# Altium schematic sheet Bank_A-B-C-D.SchDoc
size 431 x 279 mm; DrawnBy: Santiago Rodriguez; DocumentNumber: 9; Revision: V1; SheetNumber: 10; SheetTotal: 10
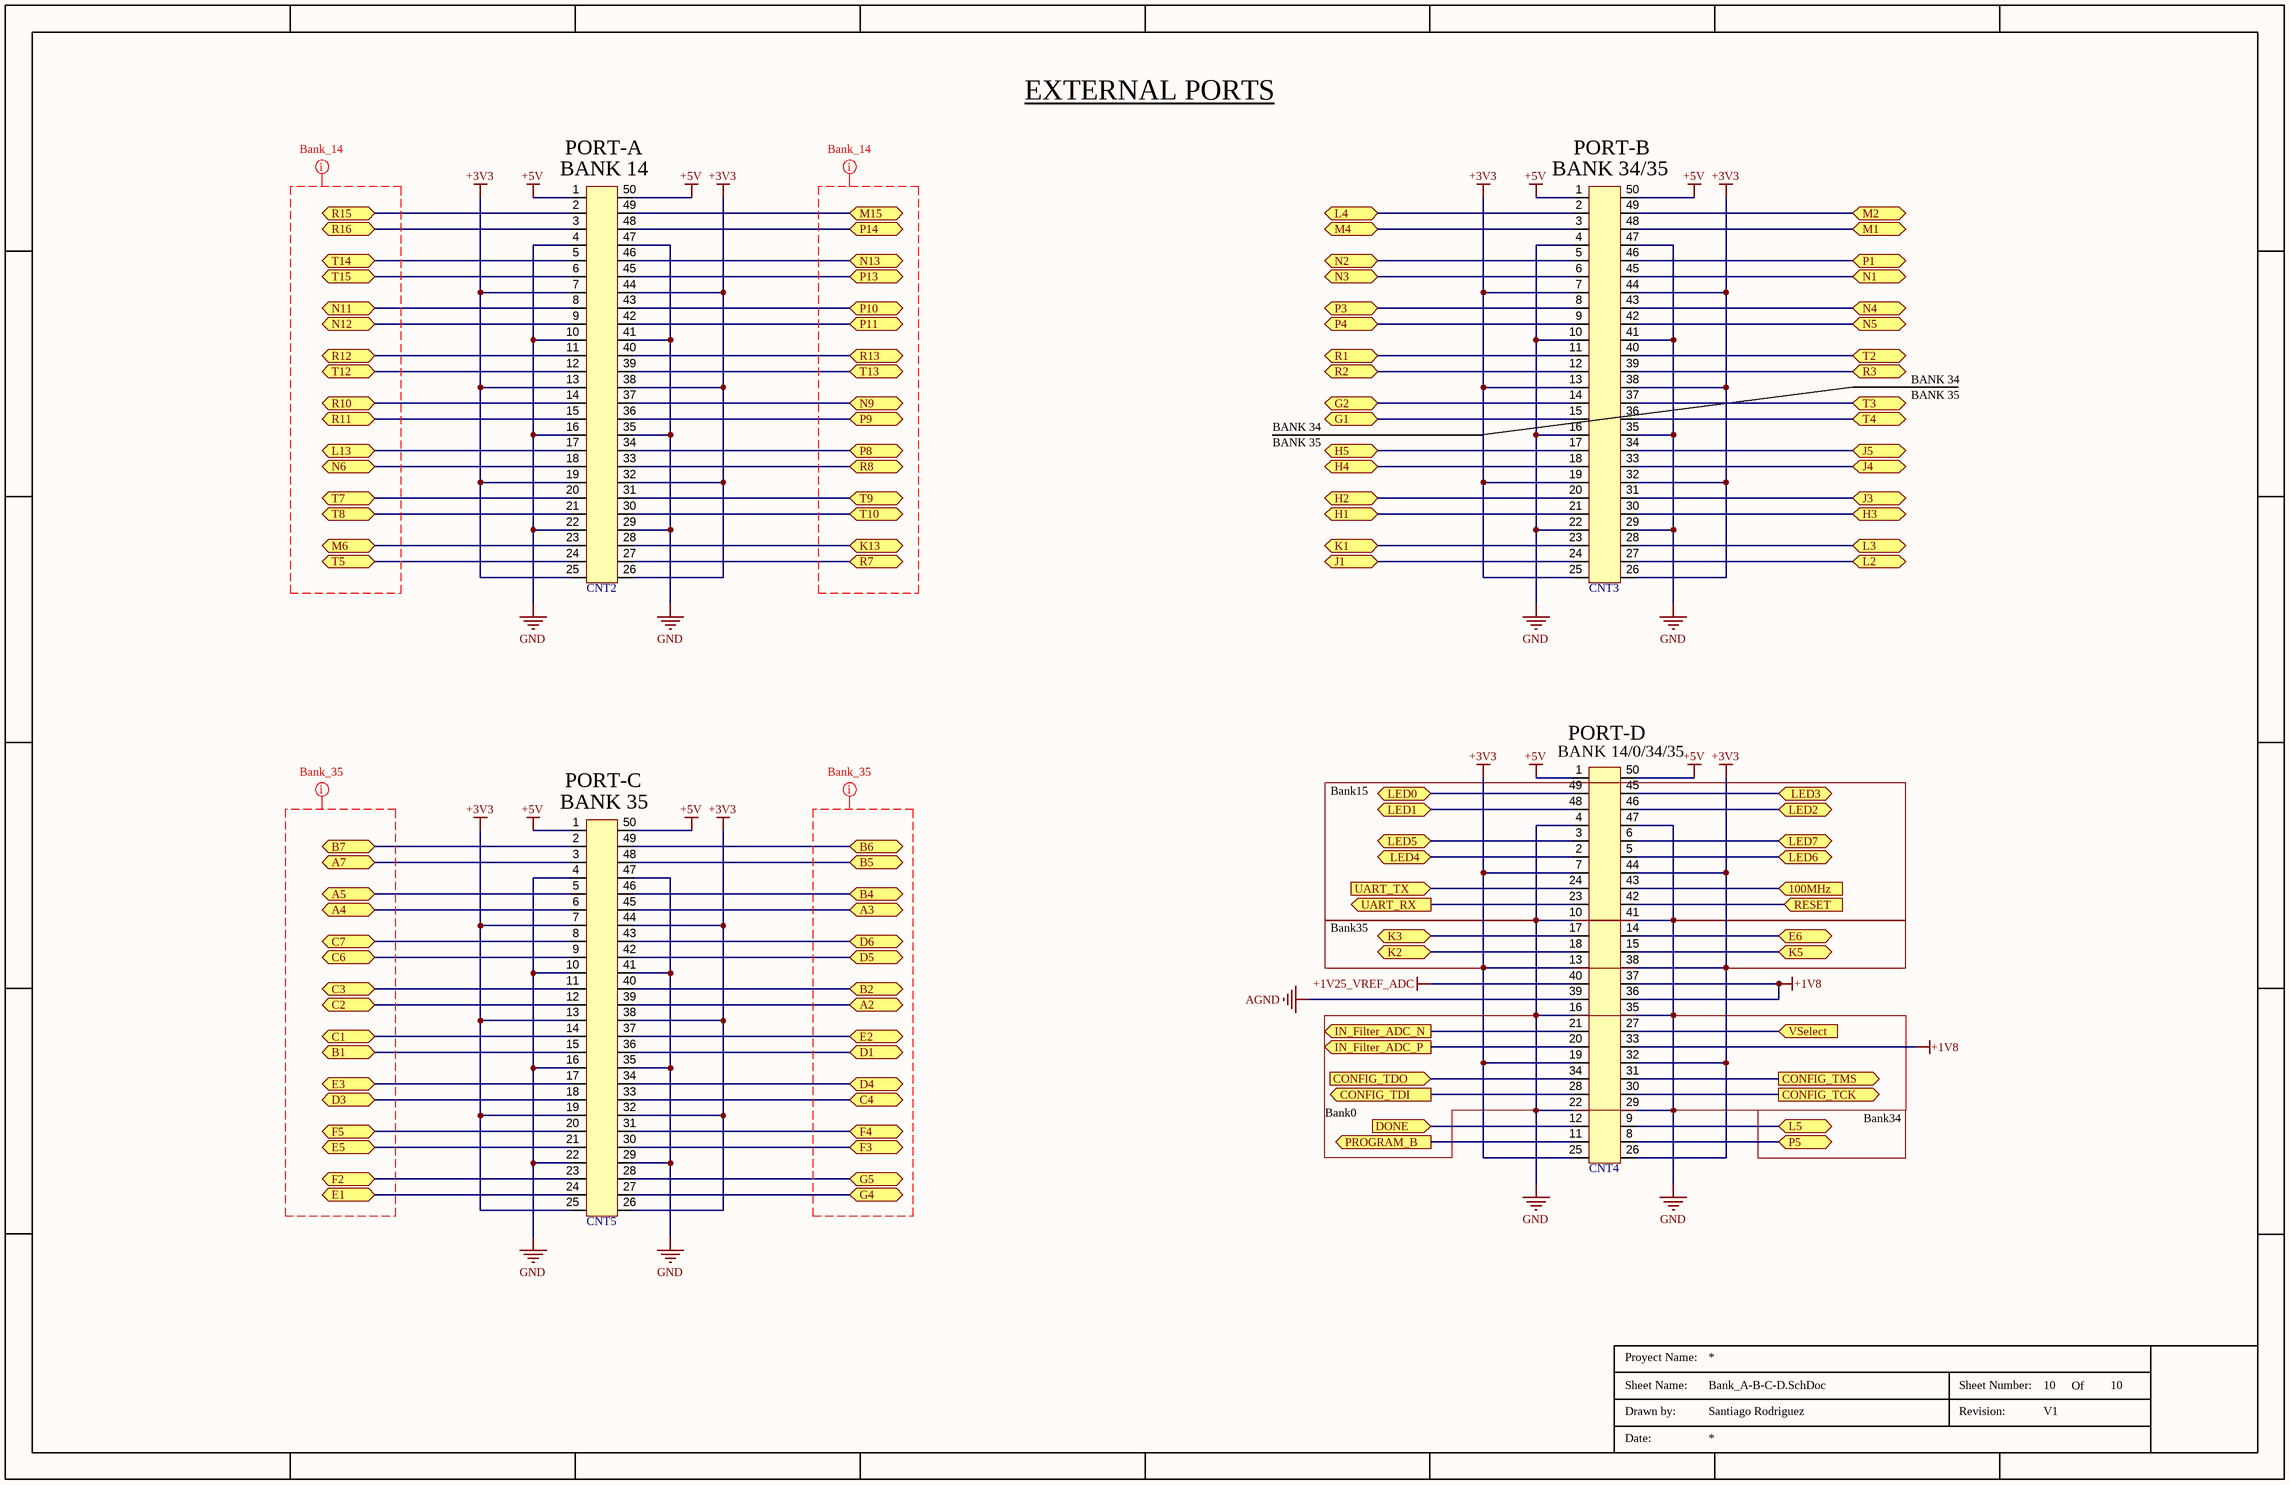
[diagram p0: Bank_A-B-C-D.SchDoc]

## Parts
CNT2  528850574  [528850574]  (value not drawn)
CNT3  528850574  [528850574]  (value not drawn)
CNT4  528850574  [528850574]  (value not drawn)
CNT5  528850574  [528850574]  (value not drawn)

## Ports
100MHz (in), A2 (bidir), A3 (bidir), A4 (bidir), A5 (bidir), A7 (bidir), B1 (bidir), B2 (bidir), B4 (bidir), B5 (bidir), B6 (bidir), B7 (bidir), C1 (bidir), C2 (bidir), C3 (bidir), C4 (bidir), C6 (bidir), C7 (bidir), CONFIG_TCK (out), CONFIG_TDI (out), CONFIG_TDO (in), CONFIG_TMS (out), D1 (bidir), D3 (bidir), D4 (bidir), D5 (bidir), D6 (bidir), DONE (in), E1 (bidir), E2 (bidir), E3 (bidir), E5 (bidir), E6 (bidir), F2 (bidir), F3 (bidir), F4 (bidir), F5 (bidir), G1 (bidir), G2 (bidir), G4 (bidir), G5 (bidir), H1 (bidir), H2 (bidir), H3 (bidir), H4 (bidir), H5 (bidir), IN_Filter_ADC_N (out), IN_Filter_ADC_P (out), J1 (bidir), J3 (bidir), J4 (bidir), J5 (bidir), K1 (bidir), K2 (bidir), K3 (bidir), K5 (bidir), K13 (bidir), L2 (bidir), L3 (bidir), L4 (bidir), L5 (bidir), L13 (bidir), LED0 (bidir), LED1 (bidir), LED2 (bidir), LED3 (bidir), LED4 (bidir), LED5 (bidir), LED6 (bidir), LED7 (bidir), M1 (bidir), M2 (bidir), M4 (bidir), M6 (bidir), M15 (bidir), N1 (bidir), N2 (bidir), N3 (bidir), N4 (bidir), N5 (bidir), N6 (bidir), N9 (bidir), N11 (bidir), N12 (bidir), N13 (bidir), P1 (bidir), P3 (bidir), P4 (bidir), P5 (bidir), P8 (bidir), P9 (bidir), P10 (bidir), P11 (bidir), P13 (bidir), P14 (bidir), PROGRAM_B (out), R1 (bidir), R2 (bidir), R3 (bidir), R7 (bidir), R8 (bidir), R10 (bidir), R11 (bidir), R12 (bidir), R13 (bidir), R15 (bidir), R16 (bidir), RESET (in), T2 (bidir), T3 (bidir), T4 (bidir), T5 (bidir), T7 (bidir), T8 (bidir), T9 (bidir), T10 (bidir), T12 (bidir), T13 (bidir), T14 (bidir), T15 (bidir), UART_RX (out), UART_TX (in), VSelect (in)

## Nets
+1V8: CNT4.33 CNT4.36 CNT4.37
+1V25_VREF_ADC: CNT4.40
+3V3: CNT2.7 CNT2.13 CNT2.19 CNT2.25 CNT2.26 CNT2.32 CNT2.38 CNT2.44 CNT3.7 CNT3.13 CNT3.19 CNT3.25 CNT3.26 CNT3.32 CNT3.38 CNT3.44 CNT4.7 CNT4.13 CNT4.19 CNT4.25 CNT4.26 CNT4.32 CNT4.38 CNT4.44 CNT5.7 CNT5.13 CNT5.19 CNT5.25 CNT5.26 CNT5.32 CNT5.38 CNT5.44
+5V: CNT2.1 CNT2.50 CNT3.1 CNT3.50 CNT4.1 CNT4.50 CNT5.1 CNT5.50
AGND: CNT4.39
GND: CNT2.4 CNT2.10 CNT2.16 CNT2.22 CNT2.29 CNT2.35 CNT2.41 CNT2.47 CNT3.4 CNT3.10 CNT3.16 CNT3.22 CNT3.29 CNT3.35 CNT3.41 CNT3.47 CNT4.4 CNT4.10 CNT4.16 CNT4.22 CNT4.29 CNT4.35 CNT4.41 CNT4.47 CNT5.4 CNT5.10 CNT5.16 CNT5.22 CNT5.29 CNT5.35 CNT5.41 CNT5.47
100MHz: CNT4.43 ; port 100MHz
A2: CNT5.39 ; port A2
A3: CNT5.45 ; port A3
A4: CNT5.6 ; port A4
A5: CNT5.5 ; port A5
A7: CNT5.3 ; port A7
B1: CNT5.15 ; port B1
B2: CNT5.40 ; port B2
B4: CNT5.46 ; port B4
B5: CNT5.48 ; port B5
B6: CNT5.49 ; port B6
B7: CNT5.2 ; port B7
C1: CNT5.14 ; port C1
C2: CNT5.12 ; port C2
C3: CNT5.11 ; port C3
C4: CNT5.33 ; port C4
C6: CNT5.9 ; port C6
C7: CNT5.8 ; port C7
CONFIG_TCK: CNT4.30 ; port CONFIG_TCK
CONFIG_TDI: CNT4.28 ; port CONFIG_TDI
CONFIG_TDO: CNT4.34 ; port CONFIG_TDO
CONFIG_TMS: CNT4.31 ; port CONFIG_TMS
D1: CNT5.36 ; port D1
D3: CNT5.18 ; port D3
D4: CNT5.34 ; port D4
D5: CNT5.42 ; port D5
D6: CNT5.43 ; port D6
DONE: CNT4.12 ; port DONE
E1: CNT5.24 ; port E1
E2: CNT5.37 ; port E2
E3: CNT5.17 ; port E3
E5: CNT5.21 ; port E5
E6: CNT4.14 ; port E6
F2: CNT5.23 ; port F2
F3: CNT5.30 ; port F3
F4: CNT5.31 ; port F4
F5: CNT5.20 ; port F5
G1: CNT3.15 ; port G1
G2: CNT3.14 ; port G2
G4: CNT5.27 ; port G4
G5: CNT5.28 ; port G5
H1: CNT3.21 ; port H1
H2: CNT3.20 ; port H2
H3: CNT3.30 ; port H3
H4: CNT3.18 ; port H4
H5: CNT3.17 ; port H5
IN_Filter_ADC_N: CNT4.21 ; port IN_Filter_ADC_N
IN_Filter_ADC_P: CNT4.20 ; port IN_Filter_ADC_P
J1: CNT3.24 ; port J1
J3: CNT3.31 ; port J3
J4: CNT3.33 ; port J4
J5: CNT3.34 ; port J5
K1: CNT3.23 ; port K1
K2: CNT4.18 ; port K2
K3: CNT4.17 ; port K3
K5: CNT4.15 ; port K5
K13: CNT2.28 ; port K13
L2: CNT3.27 ; port L2
L3: CNT3.28 ; port L3
L4: CNT3.2 ; port L4
L5: CNT4.9 ; port L5
L13: CNT2.17 ; port L13
LED0: CNT4.49 ; port LED0
LED1: CNT4.48 ; port LED1
LED2: CNT4.46 ; port LED2
LED3: CNT4.45 ; port LED3
LED4: CNT4.2 ; port LED4
LED5: CNT4.3 ; port LED5
LED6: CNT4.5 ; port LED6
LED7: CNT4.6 ; port LED7
M1: CNT3.48 ; port M1
M2: CNT3.49 ; port M2
M4: CNT3.3 ; port M4
M6: CNT2.23 ; port M6
M15: CNT2.49 ; port M15
N1: CNT3.45 ; port N1
N2: CNT3.5 ; port N2
N3: CNT3.6 ; port N3
N4: CNT3.43 ; port N4
N5: CNT3.42 ; port N5
N6: CNT2.18 ; port N6
N9: CNT2.37 ; port N9
N11: CNT2.8 ; port N11
N12: CNT2.9 ; port N12
N13: CNT2.46 ; port N13
P1: CNT3.46 ; port P1
P3: CNT3.8 ; port P3
P4: CNT3.9 ; port P4
P5: CNT4.8 ; port P5
P8: CNT2.34 ; port P8
P9: CNT2.36 ; port P9
P10: CNT2.43 ; port P10
P11: CNT2.42 ; port P11
P13: CNT2.45 ; port P13
P14: CNT2.48 ; port P14
PROGRAM_B: CNT4.11 ; port PROGRAM_B
R1: CNT3.11 ; port R1
R2: CNT3.12 ; port R2
R3: CNT3.39 ; port R3
R7: CNT2.27 ; port R7
R8: CNT2.33 ; port R8
R10: CNT2.14 ; port R10
R11: CNT2.15 ; port R11
R12: CNT2.11 ; port R12
R13: CNT2.40 ; port R13
R15: CNT2.2 ; port R15
R16: CNT2.3 ; port R16
RESET: CNT4.42 ; port RESET
T2: CNT3.40 ; port T2
T3: CNT3.37 ; port T3
T4: CNT3.36 ; port T4
T5: CNT2.24 ; port T5
T7: CNT2.20 ; port T7
T8: CNT2.21 ; port T8
T9: CNT2.31 ; port T9
T10: CNT2.30 ; port T10
T12: CNT2.12 ; port T12
T13: CNT2.39 ; port T13
T14: CNT2.5 ; port T14
T15: CNT2.6 ; port T15
UART_RX: CNT4.23 ; port UART_RX
UART_TX: CNT4.24 ; port UART_TX
VSelect: CNT4.27 ; port VSelect

## Layout directives
net class Bank_14: (no net found under the mark)
net class Bank_35: (no net found under the mark)

## Notes on the sheet
- (near CNT2) PORT-A
- EXTERNAL PORTS
- (near CNT3) PORT-B
- (near CNT2) BANK 14
- (near CNT3) BANK 34/35
- BANK 34
- BANK 35
- (near CNT4) BANK 14/0/34/35
- (near CNT4) PORT-D
- (near CNT5) BANK 35
- (near CNT5) PORT-C
- Bank15
- Bank35
- Bank0
- Bank34
- Proyect Name:
- Sheet Name:
- Drawn by:
- Revision:
- Sheet Number:
- Of
- Date:

## Library data of the parts
CNT2-CNT5 = 528850574: CONN RCPT 50POS SMD GOLD; Manufacturer: Molex; PartNumber: 0528850574; Gender: Female; ComponentLink1Description: DigiKey; ComponentLink1URL: https://www.digikey.com/es/products/detail/molex/0528850574/3197085?s=N4IgTCBcDaIAQFYwA5kIAwIOwBYQF0BfIA; ComponentLink2Description: DataSheet; ComponentLink2URL: https://www.molex.com/en-us/products/part-detail/528850574?display=pdf; PinCount: 50